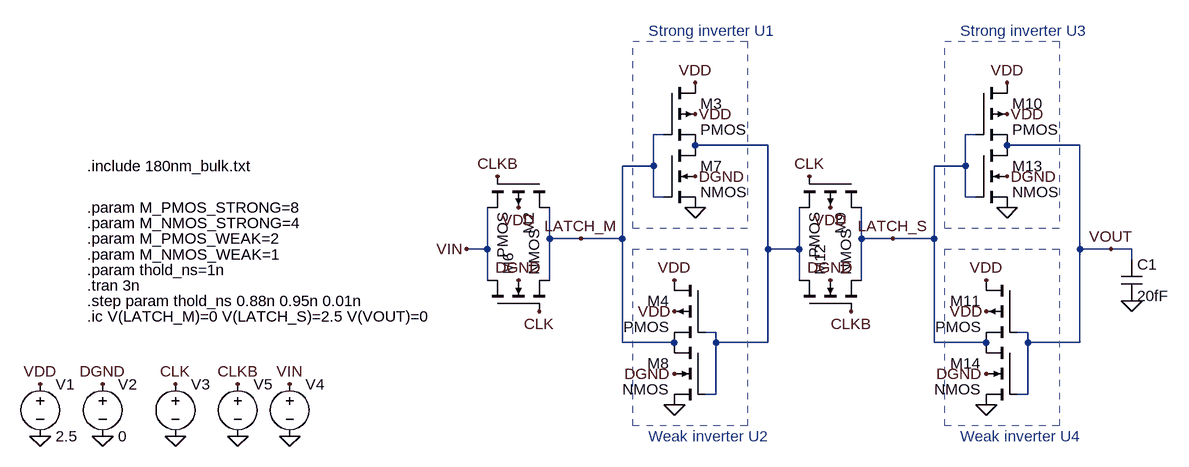
[diagram p0: schematic holdtime_testbench.asc]
holdtime_testbench.asc, the LTspice schematic file:
Version 4
SHEET 1 1472 680
WIRE 576 32 560 32
WIRE 1056 32 1040 32
WIRE 736 48 624 48
WIRE 1216 48 1104 48
WIRE 560 80 560 32
WIRE 560 80 512 80
WIRE 1040 80 1040 32
WIRE 1040 80 992 80
WIRE 560 128 560 80
WIRE 576 128 560 128
WIRE 1040 128 1040 80
WIRE 1056 128 1040 128
WIRE 400 192 400 144
WIRE 448 192 400 192
WIRE 512 192 512 80
WIRE 512 192 448 192
WIRE 880 192 880 144
WIRE 928 192 880 192
WIRE 992 192 992 80
WIRE 992 192 928 192
WIRE 304 208 304 144
WIRE 304 208 272 208
WIRE 736 208 736 48
WIRE 784 208 784 144
WIRE 784 208 736 208
WIRE 1216 208 1216 48
WIRE 1264 208 1216 208
WIRE 1296 208 1264 208
WIRE 1296 224 1296 208
WIRE 304 256 304 208
WIRE 400 256 400 192
WIRE 784 256 784 208
WIRE 880 256 880 192
WIRE 656 336 640 336
WIRE 1136 336 1120 336
WIRE 512 352 512 192
WIRE 592 352 512 352
WIRE 656 352 656 336
WIRE 736 352 736 208
WIRE 736 352 656 352
WIRE 992 352 992 192
WIRE 1072 352 992 352
WIRE 1136 352 1136 336
WIRE 1216 352 1216 208
WIRE 1216 352 1136 352
WIRE 656 432 656 352
WIRE 656 432 640 432
WIRE 1136 432 1136 352
WIRE 1136 432 1120 432
FLAG 352 144 VDD
FLAG 624 0 VDD
FLAG 592 304 VDD
FLAG 624 96 DGND
FLAG 592 400 DGND
FLAG -288 496 0
FLAG -384 496 0
FLAG 352 256 DGND
FLAG 592 448 0
FLAG 624 144 0
FLAG 592 256 VDD
FLAG 624 -48 VDD
FLAG 1296 288 0
FLAG 384 304 CLK
FLAG 320 96 CLKB
FLAG -384 416 VDD
FLAG -288 416 DGND
FLAG -176 496 0
FLAG 0 496 0
FLAG -176 416 CLK
FLAG 0 416 VIN
FLAG -80 496 0
FLAG -80 416 CLKB
FLAG 832 144 VDD
FLAG 1104 0 VDD
FLAG 1072 304 VDD
FLAG 1104 96 DGND
FLAG 1072 400 DGND
FLAG 832 256 DGND
FLAG 1072 448 0
FLAG 1104 144 0
FLAG 1072 256 VDD
FLAG 1104 -48 VDD
FLAG 864 304 CLKB
FLAG 800 96 CLK
FLAG 928 192 LATCH_S
FLAG 1264 208 VOUT
FLAG 272 208 VIN
FLAG 448 192 LATCH_M
SYMBOL pmos4 400 96 R90
SYMATTR InstName M2
SYMATTR Value2 m={M_PMOS_STRONG}
SYMBOL pmos4 576 -48 R0
SYMATTR InstName M3
SYMATTR Value2 m={M_PMOS_STRONG}
SYMBOL pmos4 640 256 M0
SYMATTR InstName M4
SYMATTR Value2 m={M_PMOS_WEAK}
SYMBOL nmos4 304 304 R270
SYMATTR InstName M6
SYMATTR Value2 m={M_NMOS_STRONG}
SYMBOL nmos4 576 48 R0
SYMATTR InstName M7
SYMATTR Value2 m={M_NMOS_STRONG}
SYMBOL nmos4 640 352 M0
SYMATTR InstName M8
SYMATTR Value2 m={M_PMOS_WEAK}
SYMBOL voltage -384 400 R0
WINDOW 123 0 0 Left 0
WINDOW 39 0 0 Left 0
SYMATTR InstName V1
SYMATTR Value 2.5
SYMBOL voltage -288 400 R0
WINDOW 123 0 0 Left 0
WINDOW 39 0 0 Left 0
SYMATTR InstName V2
SYMATTR Value 0
SYMBOL cap 1280 224 R0
SYMATTR InstName C1
SYMATTR Value 20fF
SYMBOL voltage -176 400 R0
WINDOW 3 24 96 Invisible 2
WINDOW 123 0 0 Left 0
WINDOW 39 0 0 Left 0
SYMATTR Value PULSE(0 2.5 1n 0.1n 0.1n 0.9n 10n 1)
SYMATTR InstName V3
SYMBOL voltage 0 400 R0
WINDOW 3 24 96 Invisible 2
WINDOW 123 0 0 Left 0
WINDOW 39 0 0 Left 0
SYMATTR Value PULSE(0 2.5 0.5n 0.1n 0.1n {0.5n+thold_ns} 13n 1)
SYMATTR InstName V4
SYMBOL voltage -80 400 R0
WINDOW 3 24 96 Invisible 2
WINDOW 123 0 0 Left 0
WINDOW 39 0 0 Left 0
SYMATTR Value PULSE(2.5 0 1n 0.1n 0.1n 0.9n 10n 1)
SYMATTR InstName V5
SYMBOL pmos4 880 96 R90
SYMATTR InstName M9
SYMATTR Value2 m={M_PMOS_STRONG}
SYMBOL pmos4 1056 -48 R0
SYMATTR InstName M10
SYMATTR Value2 m={M_PMOS_STRONG}
SYMBOL pmos4 1120 256 M0
SYMATTR InstName M11
SYMATTR Value2 m={M_PMOS_WEAK}
SYMBOL nmos4 784 304 R270
SYMATTR InstName M12
SYMATTR Value2 m={M_NMOS_STRONG}
SYMBOL nmos4 1056 48 R0
SYMATTR InstName M13
SYMATTR Value2 m={M_NMOS_STRONG}
SYMBOL nmos4 1120 352 M0
SYMATTR InstName M14
SYMATTR Value2 m={M_PMOS_WEAK}
TEXT -312 80 Left 2 !.include 180nm_bulk.txt
TEXT 552 -128 Left 2 ;Strong inverter U1
TEXT 552 496 Left 2 ;Weak inverter U2
TEXT -312 144 Left 2 !.param M_PMOS_STRONG=8
TEXT -312 168 Left 2 !.param M_NMOS_STRONG=4
TEXT -312 192 Left 2 !.param M_PMOS_WEAK=2
TEXT -312 216 Left 2 !.param M_NMOS_WEAK=1
TEXT -312 264 Left 2 !.tran 3n
TEXT -312 240 Left 2 !.param thold_ns=1n
TEXT -312 288 Left 2 !.step param thold_ns 0.88n 0.95n 0.01n
TEXT -312 312 Left 2 !.ic V(LATCH_M)=0 V(LATCH_S)=2.5 V(VOUT)=0
TEXT 1032 -128 Left 2 ;Strong inverter U3
TEXT 1032 496 Left 2 ;Weak inverter U4
RECTANGLE Normal 704 176 528 -112 1
RECTANGLE Normal 704 480 528 208 1
RECTANGLE Normal 1184 176 1008 -112 1
RECTANGLE Normal 1184 480 1008 208 1

The netlist it stands for:
* holdtime_testbench.asc
M2 LATCH_M CLKB VIN VDD PMOS m={M_PMOS_STRONG}
M3 VDD LATCH_M N001 VDD PMOS m={M_PMOS_STRONG}
M4 VDD N001 LATCH_M VDD PMOS m={M_PMOS_WEAK}
M6 VIN CLK LATCH_M DGND NMOS m={M_NMOS_STRONG}
M7 N001 LATCH_M 0 DGND NMOS m={M_NMOS_STRONG}
M8 LATCH_M N001 0 DGND NMOS m={M_PMOS_WEAK}
V1 VDD 0 2.5
V2 DGND 0 0
C1 VOUT 0 20fF
V3 CLK 0 PULSE(0 2.5 1n 0.1n 0.1n 0.9n 10n 1)
V4 VIN 0 PULSE(0 2.5 0.5n 0.1n 0.1n {0.5n+thold_ns} 13n 1)
V5 CLKB 0 PULSE(2.5 0 1n 0.1n 0.1n 0.9n 10n 1)
M9 LATCH_S CLK N001 VDD PMOS m={M_PMOS_STRONG}
M10 VDD LATCH_S VOUT VDD PMOS m={M_PMOS_STRONG}
M11 VDD VOUT LATCH_S VDD PMOS m={M_PMOS_WEAK}
M12 N001 CLKB LATCH_S DGND NMOS m={M_NMOS_STRONG}
M13 VOUT LATCH_S 0 DGND NMOS m={M_NMOS_STRONG}
M14 LATCH_S VOUT 0 DGND NMOS m={M_PMOS_WEAK}
.model NMOS NMOS
.model PMOS PMOS
.lib standard.mos
.include 180nm_bulk.txt
* Strong inverter U1
* Weak inverter U2
.param M_PMOS_STRONG=8
.param M_NMOS_STRONG=4
.param M_PMOS_WEAK=2
.param M_NMOS_WEAK=1
.tran 3n
.param thold_ns=1n
.step param thold_ns 0.88n 0.95n 0.01n
.ic V(LATCH_M)=0 V(LATCH_S)=2.5 V(VOUT)=0
* Strong inverter U3
* Weak inverter U4
.backanno
.end